# Altium schematic sheet LDR CKT.SchDoc
size A4; SheetNumber: 1; SheetTotal: 1
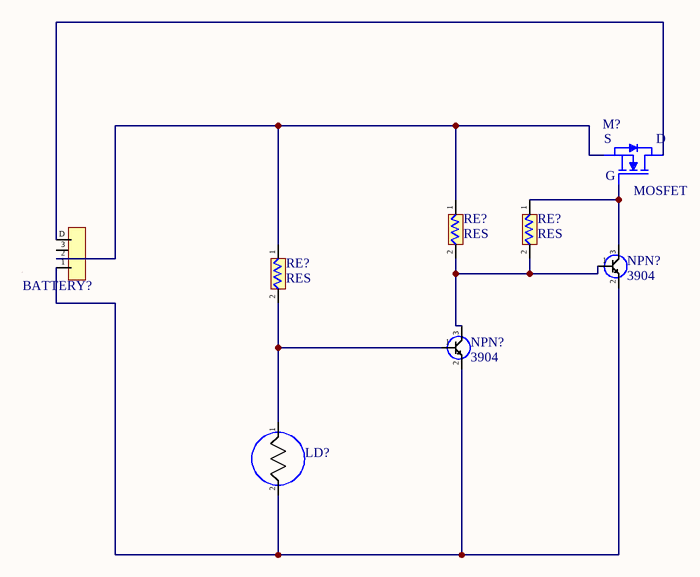
[diagram p0: LDR CKT.SchDoc]

## Parts
(Parts that share a designator on the sheet are numbered #1, #2 ... from top to bottom, then left to right.)
BATTERY?  BATTERY  [header 1]  (value not drawn)
LD?  LDR  [LDR]  (value not drawn)
M?  MOSFET  [SOT23(1)]
NPN?#1  3904  [TO92127P495H495-3]
NPN?#2  3904  [TO92127P495H495-3]
RE?#1  RES  [RESISTOR]
RE?#2  RES  [RESISTOR]
RE?#3  RES  [RESISTOR]

## Nets
NetBATTERY?_1: BATTERY?.1 LD?.2 NPN?#1.2 NPN?#2.2
NetBATTERY?_2: BATTERY?.2 M?.2(S) RE?#1.1 RE?#3.1
NetBATTERY?_D: BATTERY?.D M?.3(D)
NetLD?_1: LD?.1 NPN?#2.1 RE?#3.2
NetM?_1: M?.1(G) NPN?#1.3 RE?#2.1
NetNPN?#1_1: NPN?#1.1 NPN?#2.3 RE?#1.2 RE?#2.2

Not connected (* = marked no-connect by the designer): BATTERY? 3

## Library data of the parts
BATTERY? = BI 6V
M? = 2300 MOSFET
NPN?#1 NPN?#2 = NPN: NPN 3904
RE?#1-RE?#3 = RESISTNACE